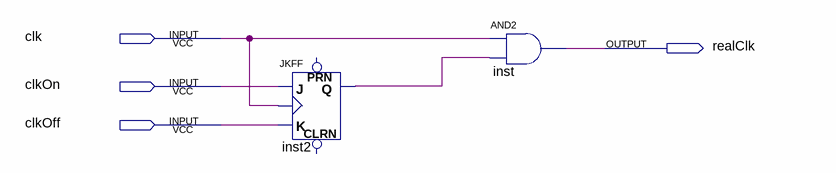
[diagram p0: schematic sheet]
// Quartus schematic clockController.bdf as structural Verilog: 2 symbols, 4 pins
module clockController (
  input  clk,
  input  clkOn,
  input  clkOff,
  output realClk
);

  wire inst2_q;

  JKFF inst2 (.K(clkOff), .J(clkOn), .CLK(clk), .Q(inst2_q));  // open: PRN, CLRN
  and inst (realClk, clk, inst2_q);
endmodule
